# EAGLE schematic Eagle101 (EAGLE 6.4)
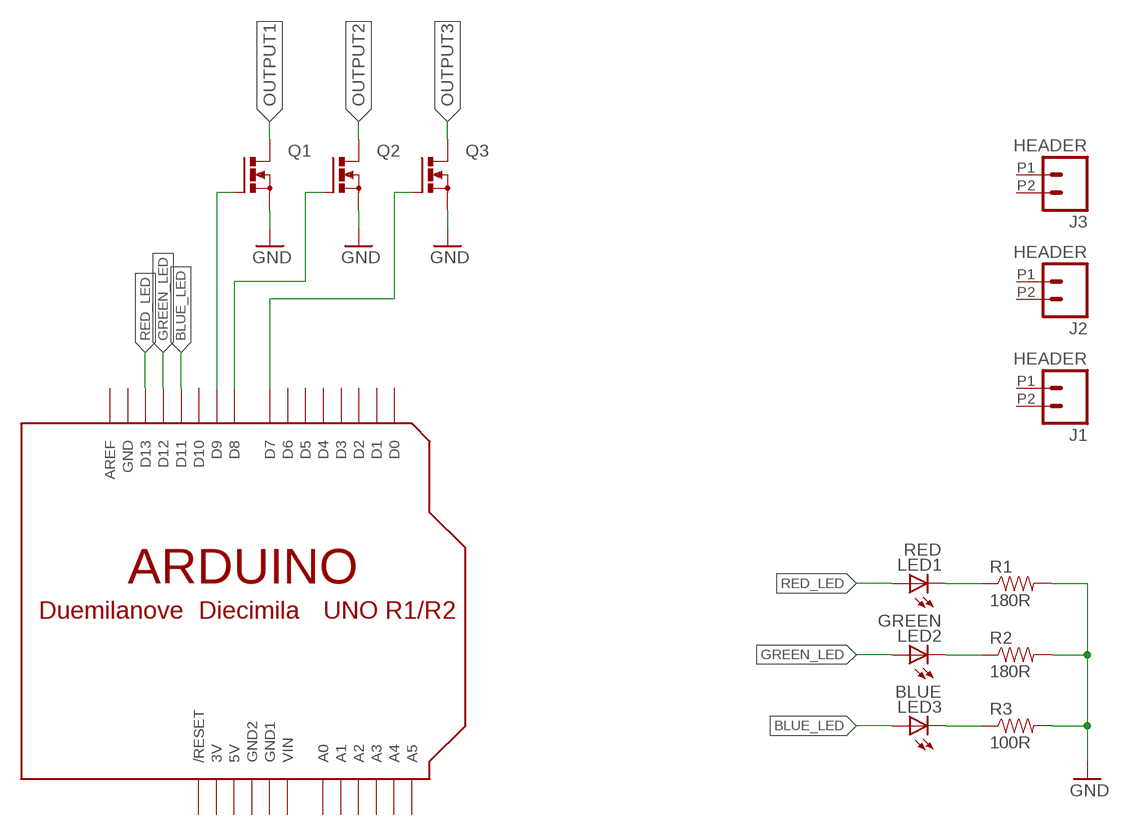
[diagram p0: schematic, sheet 1]

## Parts
J1  HEADER  [0.2-SCREWTERM]
J2  HEADER  [0.2-SCREWTERM]
J3  HEADER  [0.2-SCREWTERM]
LED1  RED  LED5MM  [LED5MM]
LED2  GREEN  LED5MM  [LED5MM]
LED3  BLUE  LED5MM  [LED5MM]
Q1  PMOSFET_NTO220BH  [TO220BH]
Q2  PMOSFET_NTO220BH  [TO220BH]
Q3  PMOSFET_NTO220BH  [TO220BH]
R1  180R  RESISTORPTH-1/4W  [AXIAL-0.4]
R2  180R  RESISTORPTH-1/4W  [AXIAL-0.4]
R3  100R  RESISTORPTH-1/4W  [AXIAL-0.4]
U$1  ARDUINO-BPLACE  [ARDUINO-BPLACE]

## Nets
BLUE_LED: LED3.A U$1.D11
GND: Q1.S Q2.S Q3.S R1.P$2 R2.P$2 R3.P$2
GREEN_LED: LED2.A U$1.D12
N$1: Q1.G U$1.D9
N$2: Q2.G U$1.D8
N$3: Q3.G U$1.D7
N$4: LED1.K(C) R1.P$1
N$5: LED2.K(C) R2.P$1
N$6: LED3.K(C) R3.P$1
OUTPUT1: Q1.D
OUTPUT2: Q2.D
OUTPUT3: Q3.D
RED_LED: LED1.A U$1.D13
Unconnected: J1.P1 J1.P2 J2.P1 J2.P2 J3.P1 J3.P2 U$1.A0 U$1.A1 U$1.A2 U$1.A3 U$1.A4 U$1.A5 U$1.AREF U$1.D0 U$1.D1 U$1.D2 U$1.D3 U$1.D4 U$1.D5 U$1.D6 U$1.D10 U$1.RESET(/RESET)

## Power pins joined to a net without a drawn wire
3V: U$1.3V
5V: U$1.5V
GND: U$1.GND
GND1: U$1.GND1
GND2: U$1.GND2
VIN: U$1.VIN

## Library data of the parts
J1-J3 = Eagle101:HEADER
LED1-LED3 = adafruit:LED: LED OSRAM: - CHIPLED LG R971, LG N971, LY N971, LG Q971, LY Q971, LO R971, LY R971 LH N974, LH R974 LS Q976, LO Q976, LY Q976 LO Q996 - Hyper CHIPLED LW Q18S LB Q993, LB Q99A, LB R99A - SideLED LS A670, LO A670, LY A670, LG A670, LP A670 LB A673, LV A673, LT A673, LW A673 LH A674 LY A675 LS A676, LA A676, LO A676, LY A676, LW A676 LS A679, LY A679, LG A679 - Hyper Micro SIDELED® LS Y876, LA Y876, LO Y876, LY Y876 LT Y87S - SmartLED LW L88C, LW L88S LB L89C, LB L89S, LG L890 LS L89K, LO L89K, LY L89K LS L896, LA L896, LO L896, LY L896 - TOPLED LS T670, LO T670, LY T670, LG T670, LP T670 LSG T670, LSP T670, LSY T670, LOP T670, LYG T670 LG T671, LOG T671, LSG T671 LB T673, LV T673, LT T673, LW T673 LH T674 LS T676, LA T676, LO T676, LY T676, LB T676, LH T676, LSB T676, LW T676 LB T67C, LV T67C, LT T67C, LS T67K, LO T67K, LY T67K, LW E67C LS E67B, LA E67B, LO E67B, LY E67B, LB E67C, LV E67C, LT E67C LW T67C LS T679, LY T679, LG T679 LS T770, LO T770, LY T770, LG T770, LP T770 LB T773, LV T773, LT T773, LW T773 LH T774 LS E675, LA E675, LY E675, LS T675 LS T776, LA T776, LO T776, LY T776, LB T776 LHGB T686 LT T68C, LB T68C - Hyper Mini TOPLED® LB M676 - Mini TOPLED Santana® LG M470 LS M47K, LO M47K, LY M47K Source: http://www.osram.convergy.de/
Q1-Q3 = transistor-power:PMOSFET_N: Power MOSFET N-Channel
R1-R3 = SparkFun-Passives:RESISTOR: Resistor Basic schematic elements and footprints for 0603, 1206, and PTH resistors.
U$1 = adafruit:ARDUINO: Arduino Diecimila/Duemilanove Make a shield with ease, this package has all the named pins as well as the two mounting drill holes and an outline of the USB and DC power connector. The outline is on the DIMENSION layer, so if your board house uses it they will cut the outline to match. http://www.ladyada.net/library/pcb/eaglelibrary.html